# EAGLE design Rov3_zasilanie_v3 (EAGLE 9.4.2)
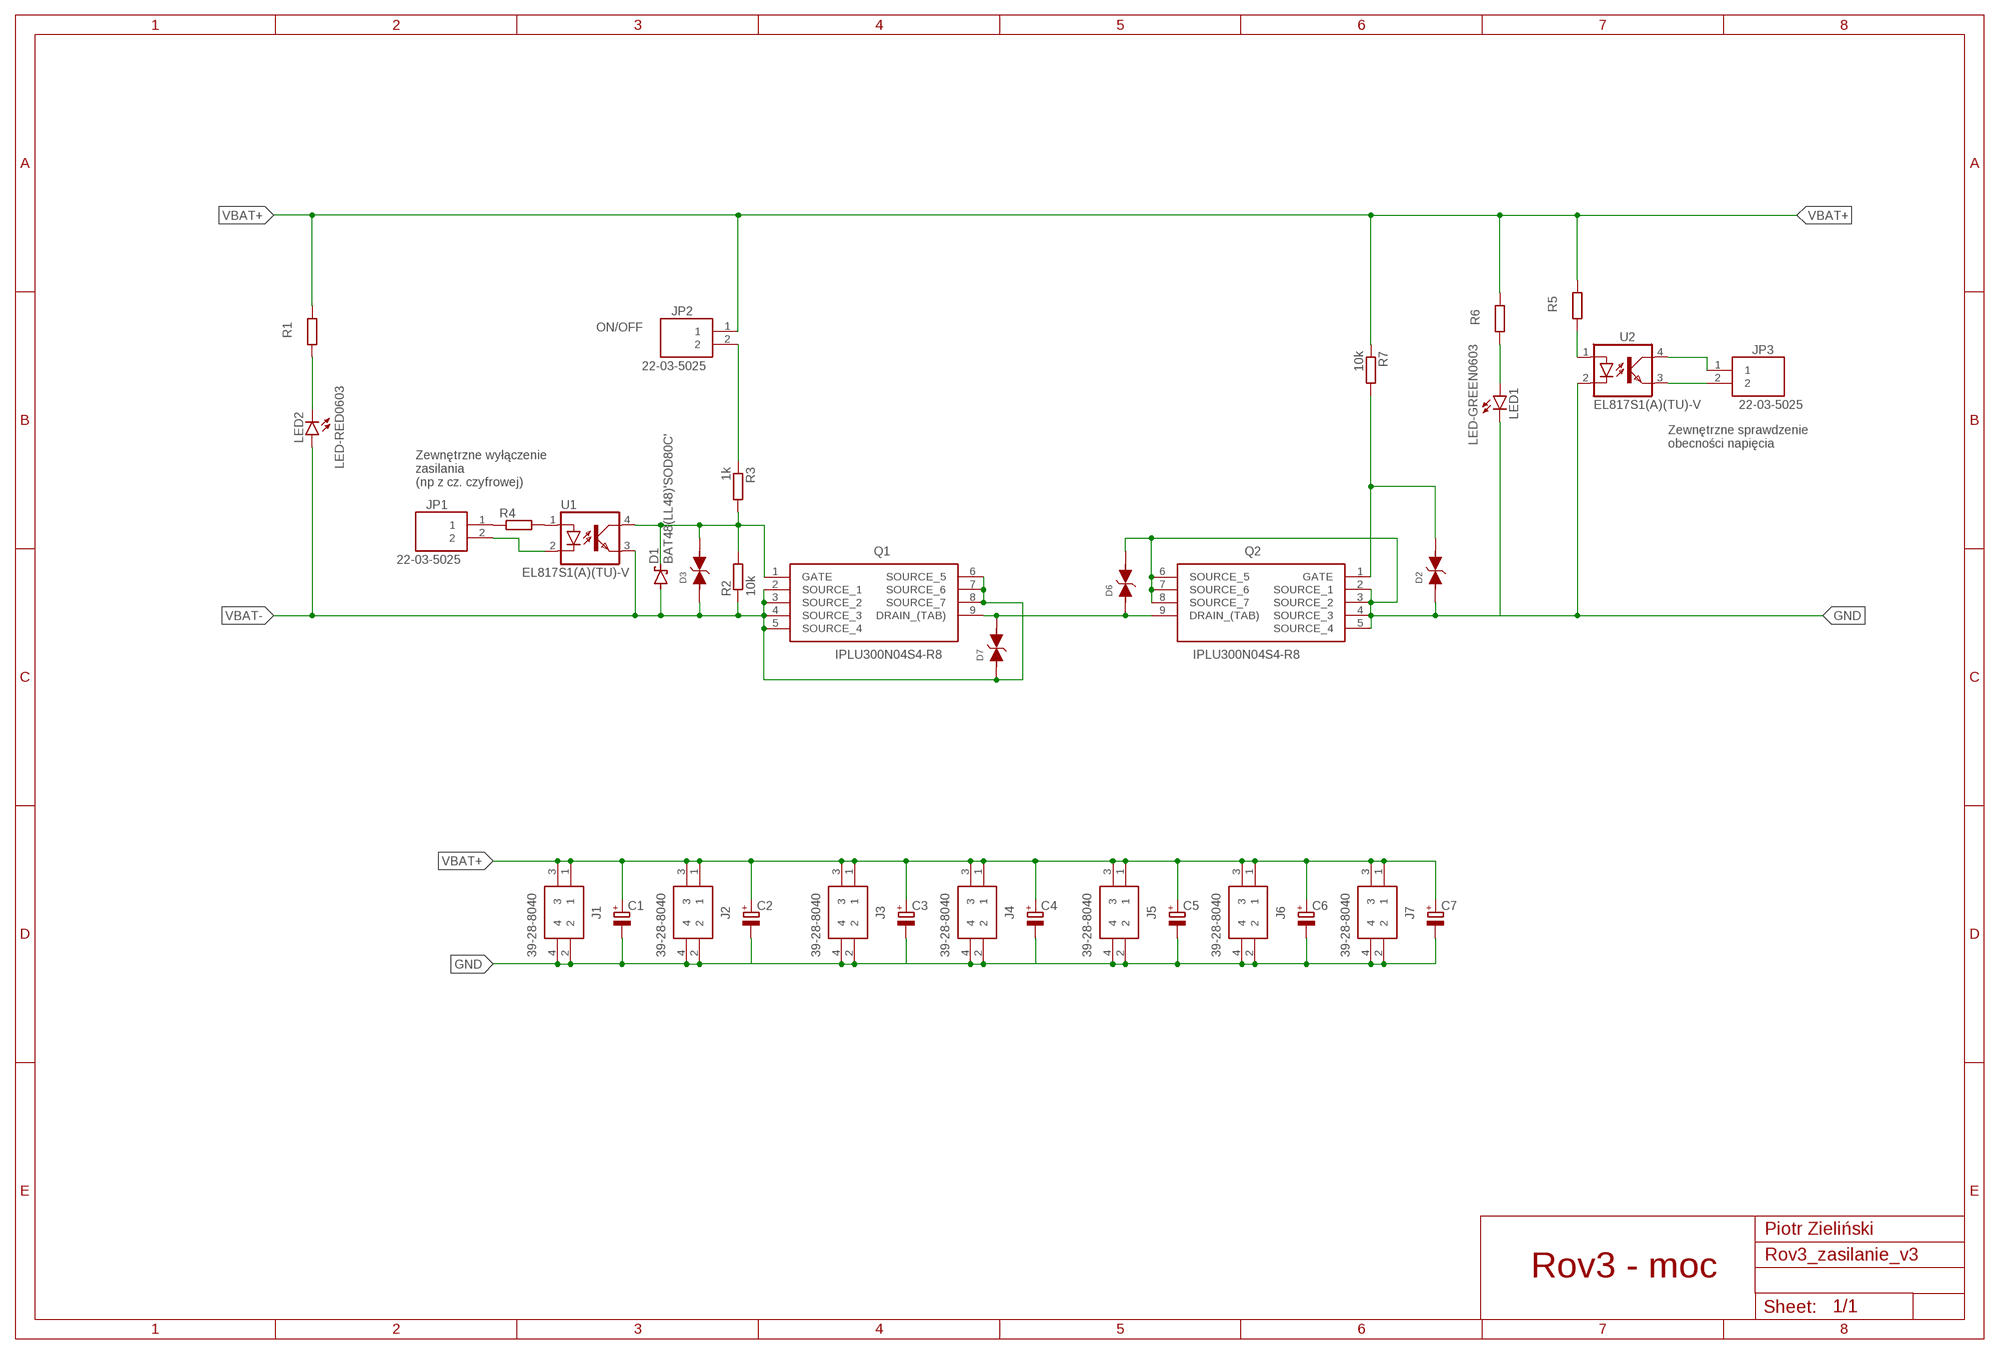
[diagram p0: schematic, sheet 1]

## Parts
C1  CPOL-EUE5-10.5  [E5-10,5]
C2  CPOL-EUE5-10.5  [E5-10,5]
C3  CPOL-EUE5-10.5  [E5-10,5]
C4  CPOL-EUE5-10.5  [E5-10,5]
C5  CPOL-EUE5-10.5  [E5-10,5]
C6  CPOL-EUE5-10.5  [E5-10,5]
C7  CPOL-EUE5-10.5  [E5-10,5]
D1  BAT48(LL48)'SOD80C'  [SOD80C]
D2  P6SMB20A_824501101  [VARTVSP_SMA/DO-214AC]
D3  P6SMB20A_824501101  [VARTVSP_SMA/DO-214AC]
D6  P6SMB20A_824501101  [VARTVSP_SMA/DO-214AC]
D7  P6SMB20A_824501101  [VARTVSP_SMA/DO-214AC]
J1  39-28-8040  [MOLEX_2X2_PCB_SOCKET]
J2  39-28-8040  [MOLEX_2X2_PCB_SOCKET]
J3  39-28-8040  [MOLEX_2X2_PCB_SOCKET]
J4  39-28-8040  [MOLEX_2X2_PCB_SOCKET]
J5  39-28-8040  [MOLEX_2X2_PCB_SOCKET]
J6  39-28-8040  [MOLEX_2X2_PCB_SOCKET]
J7  39-28-8040  [MOLEX_2X2_PCB_SOCKET]
JP1  22-03-5025  [2.50MM_MINI-SPOX_2PIN_PCB_SOCKET]
JP2  22-03-5025  [2.50MM_MINI-SPOX_2PIN_PCB_SOCKET]
JP3  22-03-5025  [2.50MM_MINI-SPOX_2PIN_PCB_SOCKET]
LED1  LED-GREEN0603  [0603-GREEN]
LED2  LED-RED0603  [0603-RED]
Q1  IPLU300N04S4-R8  [PG-HSOF-8-1]
Q2  IPLU300N04S4-R8  [PG-HSOF-8-1]
R1  R-EU_R0805  [R0805]
R2  10k  R-EU_R0805  [R0805]
R3  1k  R-EU_R0805  [R0805]
R4  R-EU_R0805  [R0805]
R5  R-EU_R0805  [R0805]
R6  R-EU_R0805  [R0805]
R7  10k  R-EU_R0805  [R0805]
U1  EL817S1(A)(TU)-V  [SOIC254P1030X390-4N_EL817S1(A)(TU)-V]
U2  EL817S1(A)(TU)-V  [SOIC254P1030X390-4N_EL817S1(A)(TU)-V]

## Nets
GND: C1.- C2.- C3.- C4.- C5.- C6.- C7.- D2.1 D6.2 J1.2 J1.4 J2.2 J2.4 J3.2 J3.4 J4.2 J4.4 J5.2 J5.4 J6.2 J6.4 J7.2 J7.4 LED1.C Q2.2(SOURCE_1) Q2.3(SOURCE_2) Q2.4(SOURCE_3) Q2.5(SOURCE_4) Q2.6(SOURCE_5) Q2.7(SOURCE_6) Q2.8(SOURCE_7) U2.2(C)
N$1 [signal]: LED1.A R6.1
N$2: D6.1 D7.2 Q1.9(DRAIN_(TAB)) Q2.9(DRAIN_(TAB))
N$3 [signal]: JP1.1 R4.1
N$4 [signal]: D1.C D3.2 Q1.1(GATE) R2.2 R3.2 U1.4(COL)
N$5 [signal]: JP1.2 U1.2(C)
N$6 [signal]: R4.2 U1.1(A)
N$7 [signal]: JP2.2 R3.1
N$8 [signal]: JP3.2 U2.3(EMIT)
N$9 [signal]: JP3.1 U2.4(COL)
N$10 [signal]: R5.1 U2.1(A)
N$11: LED2.C R1.1
N$15 [signal]: D2.2 Q2.1(GATE) R7.2
VBAT+: C1.+ C2.+ C3.+ C4.+ C5.+ C6.+ C7.+ J1.1 J1.3 J2.1 J2.3 J3.1 J3.3 J4.1 J4.3 J5.1 J5.3 J6.1 J6.3 J7.1 J7.3 JP2.1 R1.2 R5.2 R6.2 R7.1
VBAT-: D1.A D3.1 D7.1 LED2.A Q1.2(SOURCE_1) Q1.3(SOURCE_2) Q1.4(SOURCE_3) Q1.5(SOURCE_4) Q1.6(SOURCE_5) Q1.7(SOURCE_6) Q1.8(SOURCE_7) R2.1 U1.3(EMIT)

## Notes on the sheet
- ON/OFF
- Zewnętrzne sprawdzenie 
  obecności napięcia
- Zewnętrzne wyłączenie
  zasilania
  (np z cz. czyfrowej)
- Piotr Zieliński
- Rov3 - moc

## Library data of the parts
C1-C7 = rcl:CPOL-EU: POLARIZED CAPACITOR, European symbol; SPICEPREFIX: C
D1 = SamacSys_Parts:BAT48(LL48)
D2 D3 D6 D7 = SamacSys_Parts:P6SMB20A: WE-TVSP Power TVS Diode <http://katalog.we-online.de/media/images/v2/WE-TVSP_600W-3000W_D0214AA_4C.jpg> Details see: http://katalog.we-online.de/en/pbs/WE-TVSP/824500101 2015 (C) Würth Elektronik
J1-J7 = SamacSys_Parts:39-28-8040: Molex Mini-Fit Jr 5566, 4.2mm Pitch, 4 Way, 2 Row Male PCB Header Source: Datasheet <https://componentsearchengine.com/Datasheets/1/39-28-8040.pdf>; DESCRIPTION: Molex Mini-Fit Jr 5566, 4.2mm Pitch, 4 Way, 2 Row Male PCB Header; HEIGHT: 13.1mm; MANUFACTURER_NAME: Molex; MANUFACTURER_PART_NUMBER: 39-28-8040; MOUSER_PART_NUMBER: 538-39-28-8040; MOUSER_PRICE-STOCK: https://www.mouser.com/Search/Refine.aspx?Keyword=538-39-28-8040
JP1-JP3 = SamacSys_Parts:22-03-5025: Header 2.5mm SPOX,WTB,vert, shrouded, 2w Molex SPOX Series, Series Number 5267, 2.5mm Pitch 2 Way 1 Row Straight PCB Header, Solder Termination Source: Datasheet <https://componentsearchengine.com/Datasheets/1/22-03-5025.pdf>; DESCRIPTION: Header 2.5mm SPOX,WTB,vert, shrouded, 2w Molex SPOX Series, Series Number 5267, 2.5mm Pitch 2 Way 1 Row Straight PCB Header, Solder Termination; HEIGHT: 5.9mm; MANUFACTURER_NAME: Molex; MANUFACTURER_PART_NUMBER: 22-03-5025; MOUSER_PART_NUMBER: 538-22-03-5025; MOUSER_PRICE-STOCK: https://www.mouser.com/Search/Refine.aspx?Keyword=538-22-03-5025
LED1 = BeagleBone_Blue_R3:LED-GREEN
LED2 = BeagleBone_Blue_R3:LED-RED
Q1 Q2 = SamacSys_Parts:IPLU300N04S4-R8: MOSFET N-CHANNEL 30/40V Source: Datasheet <https://componentsearchengine.com/Datasheets/1/IPLU300N04S4-R8.pdf>; DESCRIPTION: MOSFET N-CHANNEL 30/40V; HEIGHT: mm; MANUFACTURER_NAME: Infineon; MANUFACTURER_PART_NUMBER: IPLU300N04S4-R8; MOUSER_PART_NUMBER: 726-IPLU300N04S4-R8; MOUSER_PRICE-STOCK: https://www.mouser.com/Search/Refine.aspx?Keyword=726-IPLU300N04S4-R8
R1-R7 = rcl:R-EU_: RESISTOR, European symbol; SPICEPREFIX: R
U1 U2 = SamacSys_Parts:EL817S1(A)(TU)-V: Optoisoltr 5kv Transistor 4-Smd; AVAILABILITY: Unavailable; DESCRIPTION: Optoisoltr 5kv Transistor 4-Smd; MF: Everlight Electronics; MP: EL817S1_A__TU_-V; PACKAGE: SMD-4 Everlight Electronics; PRICE: None

## Net classes
0 supply: width 0.5 mm, clearance 0.3 mm
1 signal: width 0.4 mm, drill 0.4 mm, clearance 0.3 mm

## Board
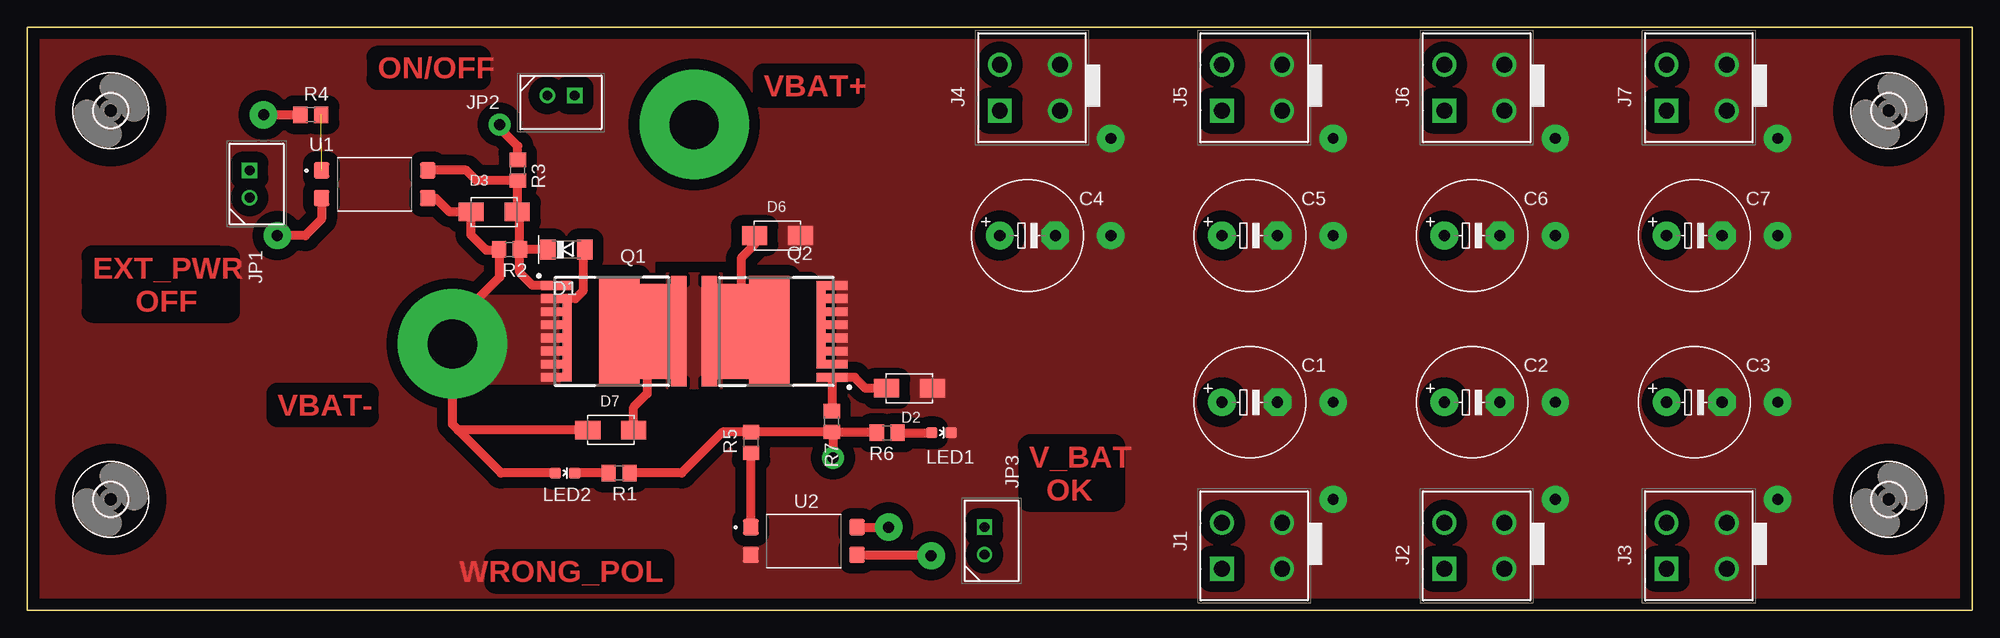
[diagram p1: board, top side]
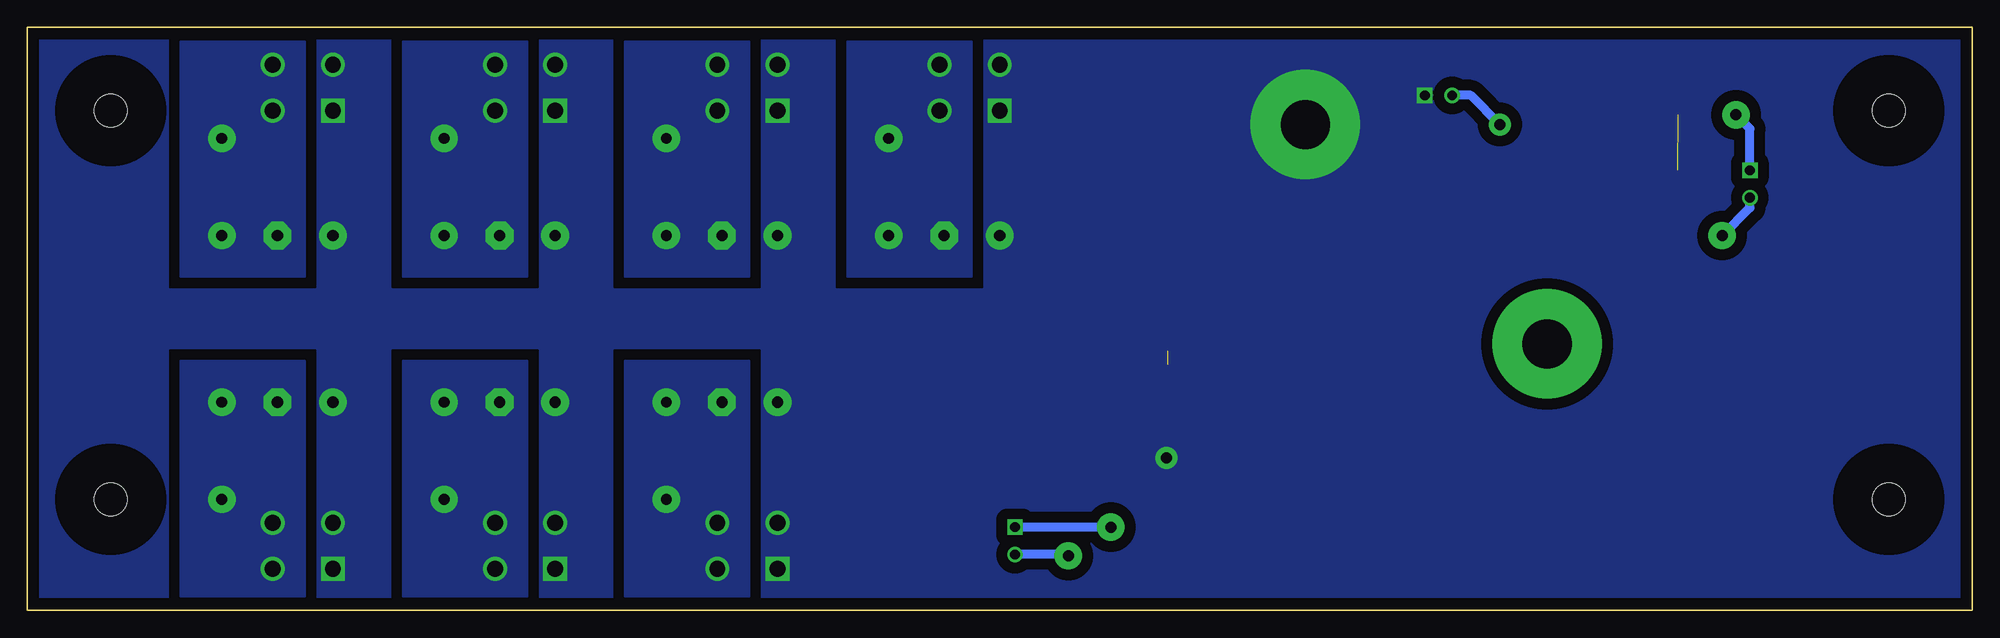
[diagram p2: board, bottom side, seen from below]

Size 177.8 x 53.34 mm. Coordinates in mm from the lower left corner, seen from the top.
Outline: 0,0 177.8,0 177.8,53.34 0,53.34 0,0
Copper layers (1*16): Top 0.035mm / dielectric 1.5mm / Bottom 0.035mm
Design rules "default *": minimum track width 6mil, minimum drill 0.35mm, track to track 6mil, track to pad 6mil, pad to pad 6mil, via to via 6mil, smd to smd 6mil, copper to edge 40mil, drill to drill 6mil, minimum pad ring 10mil, minimum via ring 8mil, stop-mask expansion 4mil, vias tented up to drill 0mil, thermal gap 0mil
tRestrict: area 70.4,20.4 to 71.5,30; area 42.8,2.5 to 58.2,4.6; area 22.9,17.8 to 31.1,19.8; area 6,30.1 to 17.4,32.4; area 10.9,27.3 to 15.2,29.3; area 32.1,48.6 to 41.3,50.7; area 67.3,47 to 75.6,49; area 91.7,13 to 99.3,15.1; area 93.7,10 to 96.8,12.1

### Footprints (pad centres in the part's own frame; a part is rotated, then mirrored left to right if it is on the bottom)
E5-10,5 = drill 1.016 pad 2.54: + -2.54,0 | drill 1.016 pad 2.54 octagon: - 2.54,0
SOD80C = smd 1.4 x 1.8: A 1.7,0; C -1.7,0
VARTVSP_SMA/DO-214AC = smd 2.3 x 1.7: 1 -2.1,0; 2 2.1,0
MOLEX_2X2_PCB_SOCKET = drill 1.45 pad 2.175 square: 1 -2.54,2.54 | drill 1.45 pad 2.175: 2 -2.54,-2.96; 3 1.66,2.54; 4 1.66,-2.96
2.50MM_MINI-SPOX_2PIN_PCB_SOCKET = drill 0.9 pad 1.35 square: 1 1.27,0 | drill 0.9 pad 1.35: 2 -1.23,0
0603-GREEN = smd 1 x 1: A 0,-0.877; C 0,0.877
0603-RED = smd 1 x 1: A 0,-0.877; C 0,0.877
PG-HSOF-8-1 = smd 0.8 x 2.8: 1 -4.33,-4.982; 2 -3.13,-4.982; 3 -1.93,-4.982; 4 -0.73,-4.982; 5 0.47,-4.982; 6 1.67,-4.982; 7 2.87,-4.982; 8 4.07,-4.982 | smd 8.7 x 8: 9 -0.13,2.918 | smd 0.5 x 0.8: 10 -2.53,-3.982; 11 -1.33,-3.982; 12 -0.13,-3.982; 13 1.07,-3.982; 14 2.27,-3.982; 15 3.47,-3.982 | smd 0.7 x 3.7: 16 -4.83,0.768; 17 4.57,0.768 | smd 0.7 x 1.4: 18 -4.83,6.218; 19 4.57,6.218
R0805 = smd 1.3 x 1.5: 1 -0.95,0; 2 0.95,0
SOIC254P1030X390-4N_EL817S1(A)(TU)-V = smd 1.41 x 1.47: 1 -4.85,1.27; 2 -4.85,-1.27; 3 4.85,-1.27; 4 4.85,1.27
3,0 = hole 3: 0,0

### Placement (x,y rotation side)
C1  111.76,19.05 0 top
C2  132.08,19.05 0 top
C3  152.4,19.05 0 top
C4  91.44,34.29 0 top
C5  111.76,34.29 0 top
C6  132.08,34.29 0 top
C7  152.4,34.29 0 top
D1  49.28,33.02 0 top
D2  80.64,20.32 180 top
D3  42.67,36.45 0 top
D6  68.58,34.29 0 top
D7  53.34,16.51 0 top
J1  111.76,6.35 90 top
J2  132.08,6.35 90 top
J3  152.4,6.35 90 top
J4  91.44,48.26 90 top
J5  111.76,48.26 90 top
J6  132.08,48.26 90 top
J7  152.4,48.26 90 top
JP1  20.32,38.99 90 top
JP2  48.77,47.12 0 top
JP3  87.5,6.35 90 top
LED1  83.57,16.26 270 top
LED2  49.15,12.57 270 top
Q1  53.34,25.4 270 top
Q2  68.58,25.65 90 top
R1  54.1,12.57 0 top
R2  44.07,33.02 0 top
R3  44.83,40.26 270 top
R4  25.91,45.34 0 top
R5  66.17,15.37 90 top
R6  78.61,16.26 180 top
R7  73.53,17.27 90 top
U1  31.75,38.99 0 top
U2  70.99,6.35 0 top
U$1  [3,0]  7.62,10.16 0 top
U$2  [3,0]  7.62,45.72 0 top
U$3  [3,0]  170.18,45.72 0 top
U$4  [3,0]  170.18,10.16 0 top

### Tracks (layer width: path | path; a pad name or v marks a point on that pad's centre or on a via)
GND  (via drill 1 pad 2.5)  (1 unrouted)
  other vias: 119.38,19.05 119.38,10.16 139.7,19.05 139.7,10.16 160.02,10.16 160.02,19.05 160.02,34.29 160.02,43.18 139.7,43.18 139.7,34.29 119.38,43.18 119.38,34.29 99.06,43.18 99.06,34.29
  pour Top (isolate 1, rank 3): 0,0 177.8,0 177.8,53.34 0,53.34
  pour Bottom (isolate 1): 91.44,30.48 91.44,52.07 102.87,52.07 102.87,30.48
  pour Bottom (isolate 1): 111.76,30.48 111.76,52.07 123.19,52.07 123.19,30.48
  pour Bottom (isolate 1): 132.08,1.27 132.08,22.86 143.51,22.86 143.51,1.27
  pour Bottom (isolate 1): 152.4,1.27 152.4,22.86 163.83,22.86 163.83,1.27
  pour Bottom (isolate 1): 111.76,1.27 111.76,22.86 123.19,22.86 123.19,1.27
  pour Bottom (isolate 1): 132.08,30.48 132.08,52.07 143.51,52.07 143.51,30.48
  pour Bottom (isolate 1): 152.4,30.48 152.4,52.07 163.83,52.07 163.83,30.48
N$1
  Top 0.813: R6.1 LED1.A
N$2
  Top 0.813: D6.1 66.48,33.46 65.26,32.24 65.26,29.33 65.66,28.92 Q2.9 | Q1.9 56.26,21.88 56.66,21.47 56.66,19.83 55.44,18.61 D7.2
  Top 1: 56.52,25.27 Q1.9
  pour Top (no thermals): 63.5,30.86 58.42,30.86 58.42,20.32 63.5,20.32
N$3  (via drill 1 pad 2.5)
  Top 0.813: v21.59,45.34 R4.1
  Bottom 0.813: v21.59,45.34 20.32,44.07 JP1.1
N$4
  Top 0.5: D3.2 45.02,36.2 45.27,36.45 | R3.2 44.77,39.25
  Top 0.8: Q1.1 46.22,29.73
  Top 0.813: R2.2 45.02,30.93 46.22,29.73 | R2.2 45.02,36.2 | 44.77,39.25 D3.2 44.82,36.5 | R3.2 41.08,39.31 40.13,40.26 U1.4 | D1.C R2.2
N$5  (via drill 1 pad 2.5)
  Top 0.813: U1.2 26.9,35.79 25.4,34.29 v22.86,34.29
  Bottom 0.813: v22.86,34.29 20.32,36.83 JP1.2
N$6  (1 unrouted)
N$7  (via drill 1 pad 2)
  Top 0.813: R3.1 44.83,42.48 43.18,44.13 v43.18,44.45
  Bottom 0.813: v43.18,44.45 45.85,47.12 JP2.2
N$8  (via drill 1 pad 2.5)
  Top 0.5: JP3.2 87.46,5.08
  Top 0.813: U2.3 82.62,5.08 v82.62,5
  Bottom 0.813: v82.62,5 82.62,5.12 JP3.2
N$9  (via drill 1 pad 2.5)
  Top 0.813: U2.4 v78.74,7.62
  Bottom 0.813: v78.74,7.62 JP3.1
N$10
  Top 0.5: 66.14,14.39 R5.1
  Top 0.813: U2.1 66.14,14.39
N$11
  Top 0.813: R1.1 LED2.C
N$15
  Top 0.5: 73.56,18.25 R7.2
  Top 0.813: 73.56,18.25 Q2.1 75.64,21.32 76.64,20.32 D2.2
VBAT+  (via drill 1 pad 2, 4.5 pad 10)
  Top 0.5: 77.6,16.32 R6.2 | R7.1 73.66,16.2 | R5.2
  Top 0.813: 77.6,16.32 R7.1 R5.2 | 73.66,16.2 v73.66,13.97 | R5.2 63.56,16.32 59.82,12.57 R1.2
  other vias: 60.96,44.45
  pour Bottom (isolate 1, rank 2): 0,0 0,53.34 177.8,53.34 177.8,0
VBAT-  (via drill 4.5 pad 10)
  Top 0.5: 48.67,28.53 Q1.2 | 43.18,32.96 R2.1 41.91,33.02
  Top 0.61: 41.91,33.02 41.97,32.96
  Top 0.8: 50.8,29.21 50.12,28.53 48.67,28.53
  Top 0.813: 39.37,16.51 43.31,12.57 LED2.A | 39.37,16.51 38.86,17.02 v38.86,24.38 38.86,26.16 43.18,30.48 43.18,32.96 41.97,32.96 | U1.3 37.34,37.72 38.61,36.45 D3.1 40.57,34.36 41.91,33.02 | D7.1 39.37,16.51 | D1.A 50.8,32.84 50.8,29.21
  pour Top (rank 2, no thermals): 48.64,28.83 37.21,28.83 37.21,20.7 48.64,20.7

### Text on the board
Top: ON/OFF | VBAT+ | EXT_PWR / OFF | VBAT- | V_BAT / OK | WRONG_POL